# EAGLE design H0FR10 (EAGLE 9.6.1)

## Sheet 1 of 2
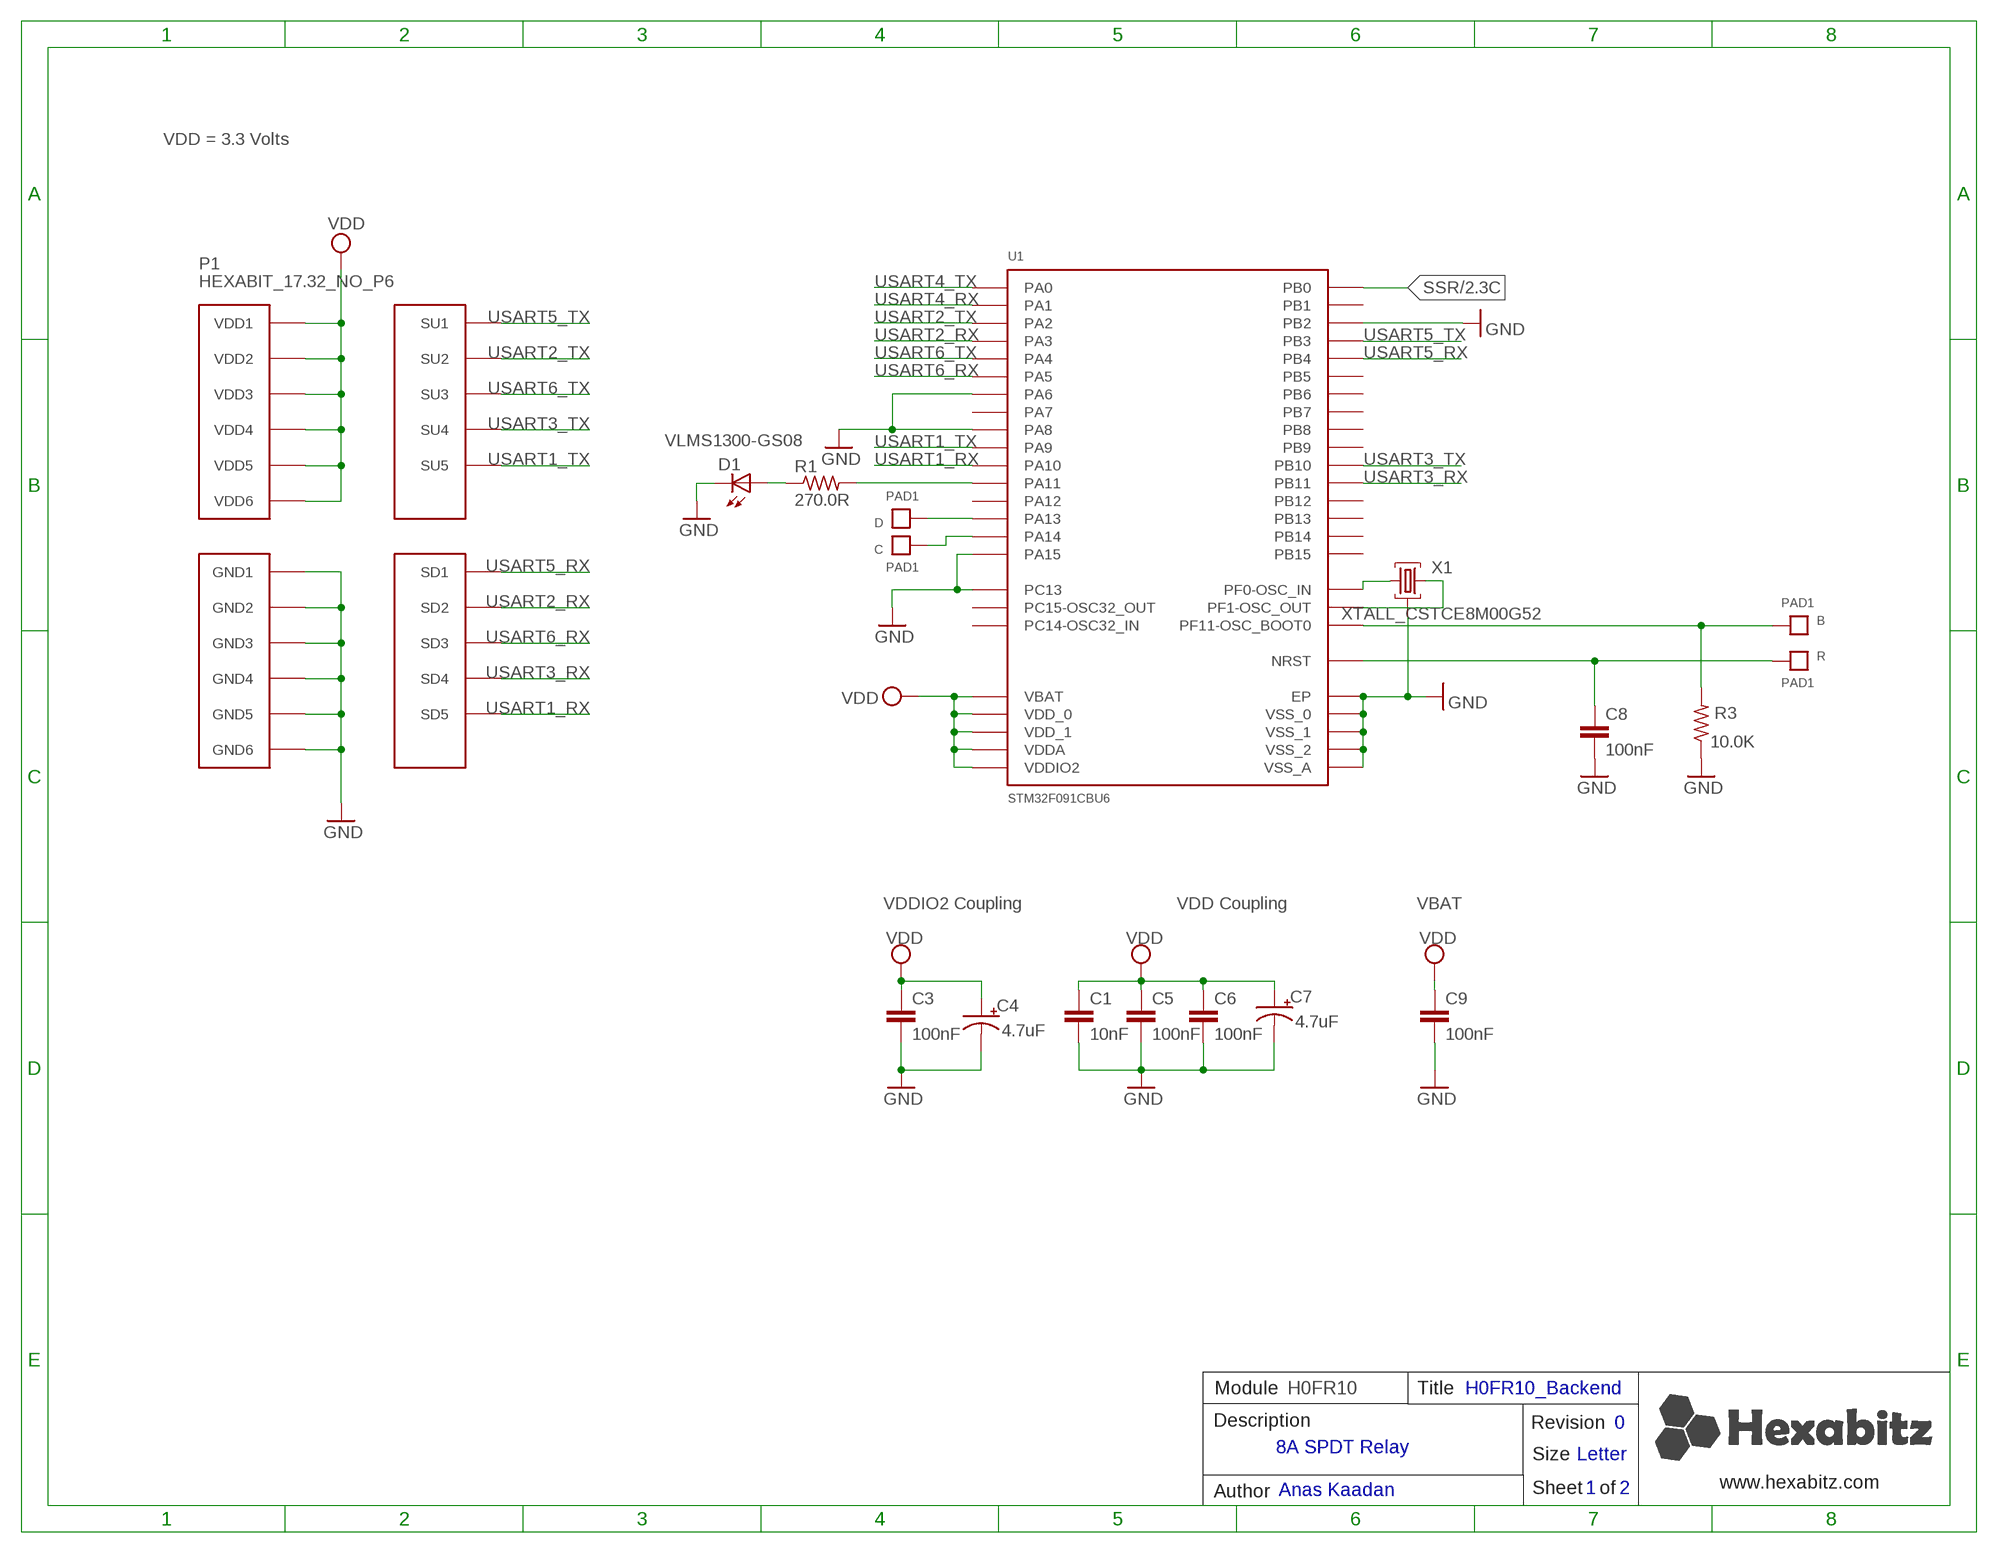
[diagram p0: schematic, sheet 1]

### Parts
B  PAD1  [PAD1]
C  PAD1  [PAD1]
C1  10nF  C-0603  [C-0603]
C3  100nF  C-0603  [C-0603]
C4  4.7uF  C-0805-POL  [C-0805-POL]
C5  100nF  C-0603  [C-0603]
C6  100nF  C-0603  [C-0603]
C7  4.7uF  C-0805-POL  [C-0805-POL]
C8  100nF  C-0603  [C-0603]
C9  100nF  C-0603  [C-0603]
D  PAD1  [PAD1]
D1  VLMS1300-GS08  [VLMS1300-GS08]
P1  HEXABIT_17.32_NO_P6  [HEXABIT_17.32_NO_P6]
R  PAD1  [PAD1]
R1  270.0R  R-0603  [R-0603]
R3  10.0K  R-0603  [R-0603]
U1  STM32F091CBU6  [STM32F091CBU6]
X1  XTALL_CSTCE8M00G52  [XTALL_CSTCE8M00G52]

### Nets
B1: B.P$1 B.P$2 R3.2 U1.P$44(PF11-OSC_BOOT0)
GND: C1.2 C3.2 C4.2(-) C5.2 C6.2 C7.2(-) C8.2 C9.2 D1.C P1.PAD_PD7(GND1) P1.PAD_PD8(GND2) P1.PAD_PD9(GND3) P1.PAD_PD10(GND4) P1.PAD_PD11(GND5) P1.PAD_PD12(GND6) R3.1 U1.EP U1.P$2(PC13) U1.P$8(VSS_A) U1.P$16(PA6) U1.P$20(PB2) U1.P$23(VSS_0) U1.P$29(PA8) U1.P$35(VSS_1) U1.P$38(PA15) U1.P$47(VSS_2) X1.P$2 ; also sheet 2
N$3: R1.2 U1.P$32(PA11)
N$4: D1.A R1.1
N$5: U1.P$5(PF0-OSC_IN) X1.P$1
N$6: U1.P$6(PF1-OSC_OUT) X1.P$3
N$7: D.P$1 D.P$2 U1.P$34(PA13)
N$9: C.P$1 C.P$2 U1.P$37(PA14)
R1: C8.1 R.P$1 R.P$2 U1.P$7(NRST)
SSR: U1.P$18(PB0) ; also sheet 2
USART1_RX: P1.PAD_PD5(SD5) U1.P$31(PA10)
USART1_TX: P1.PAD_PU5(SU5) U1.P$30(PA9)
USART2_RX: P1.PAD_PD2(SD2) U1.P$13(PA3)
USART2_TX: P1.PAD_PU2(SU2) U1.P$12(PA2)
USART3_RX: P1.PAD_PD4(SD4) U1.P$22(PB11)
USART3_TX: P1.PAD_PU4(SU4) U1.P$21(PB10)
USART4_RX: U1.P$11(PA1)
USART4_TX: U1.P$10(PA0)
USART5_RX: P1.PAD_PD1(SD1) U1.P$40(PB4)
USART5_TX: P1.PAD_PU1(SU1) U1.P$39(PB3)
USART6_RX: P1.PAD_PD3(SD3) U1.P$15(PA5)
USART6_TX: P1.PAD_PU3(SU3) U1.P$14(PA4)
VDD: C1.1 C3.1 C4.1(+) C5.1 C6.1 C7.1(+) C9.1 P1.PAD_PU7(VDD1) P1.PAD_PU8(VDD2) P1.PAD_PU9(VDD3) P1.PAD_PU10(VDD4) P1.PAD_PU11(VDD5) P1.PAD_PU12(VDD6) U1.P$1(VBAT) U1.P$9(VDDA) U1.P$24(VDD_0) U1.P$36(VDDIO2) U1.P$48(VDD_1) ; also sheet 2
Unconnected: U1.P$3(PC14-OSC32_IN) U1.P$4(PC15-OSC32_OUT) U1.P$17(PA7) U1.P$19(PB1) U1.P$25(PB12) U1.P$26(PB13) U1.P$27(PB14) U1.P$28(PB15) U1.P$33(PA12) U1.P$41(PB5) U1.P$42(PB6) U1.P$43(PB7) U1.P$45(PB8) U1.P$46(PB9)

### Notes on the sheet
- VDD = 3.3 Volts
- VDDIO2 Coupling | VDD Coupling | VBAT
- Module | H0FR10 | Title | H0FR10_Backend
- Description | Revision | 0
- 8A SPDT Relay
- Size | Letter
- www.hexabitz.com
- Author | Anas Kaadan | Sheet   of | 1 | 2
- C:/Users/Admin/Desktop/logodraft.bmp

## Sheet 2 of 2
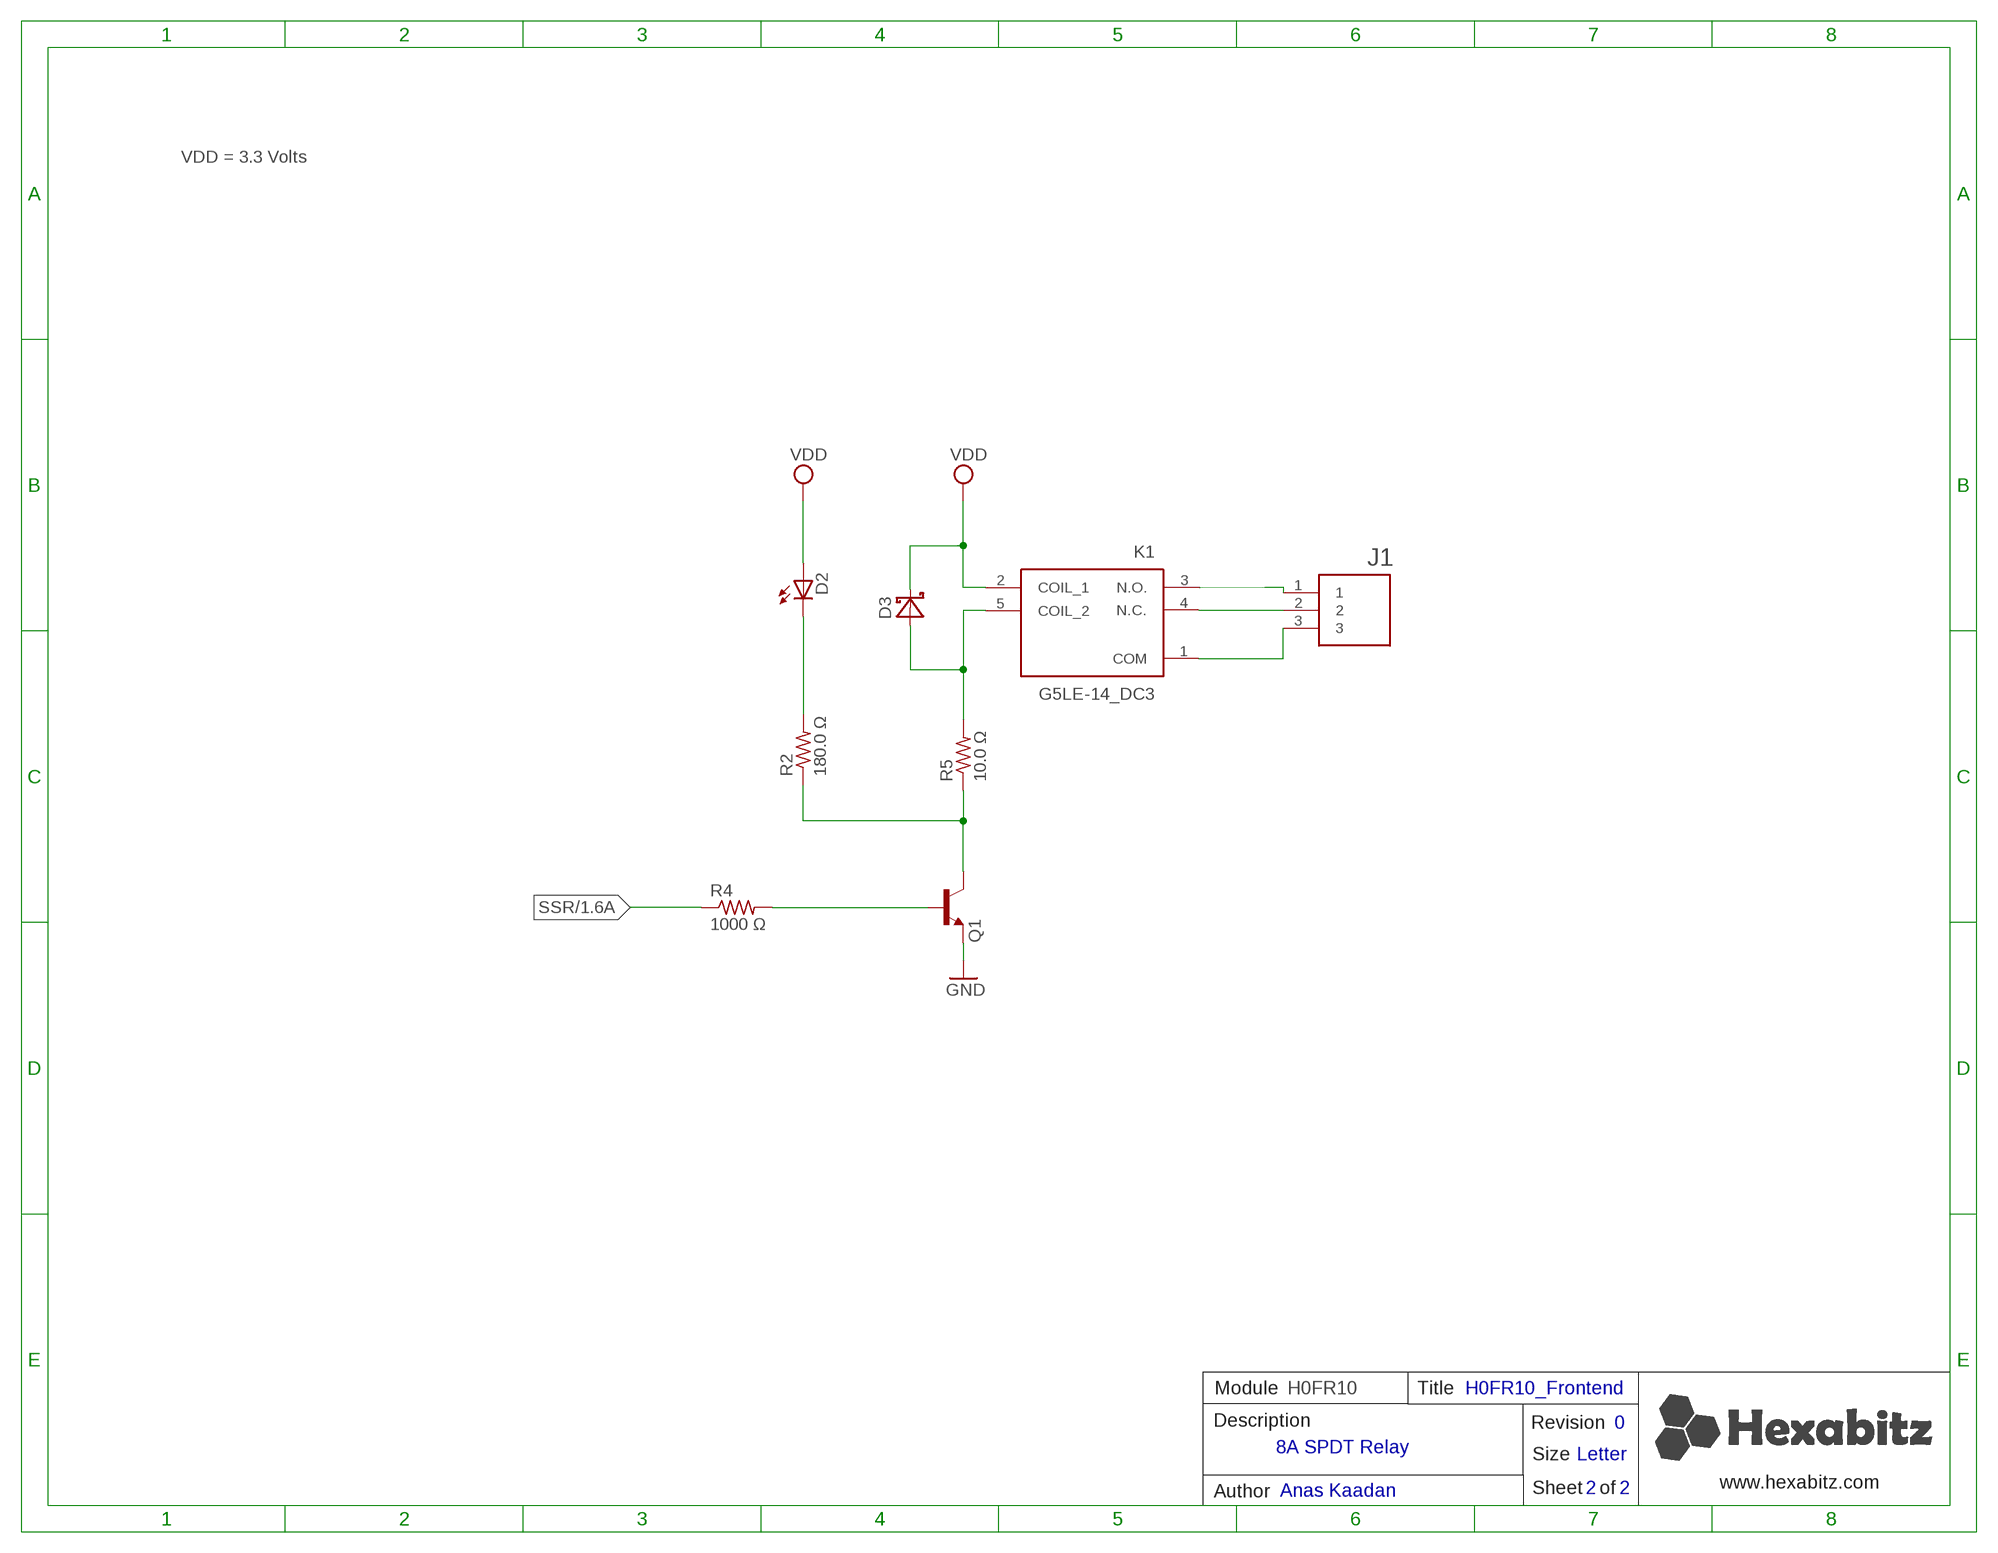
[diagram p1: schematic, sheet 2]

### Parts
D2  VLMS1300-GS08  [VLMS1300-GS08]
D3  SMD-DIODE-SCHOTTKY-40V-300MA(SOD-323)  [SOD-323]
J1  CON-PHOENIX-350_1755749  [SHDR3W100P0X508_1X3_1724X860X1]
K1  G5LE-14_DC3  [G5LE-14_SPDT]
Q1  MMBT3904LT1  [MMBT3904LT1]
R2  180.0 Ω  R-0603  [R-0603]
R4  1000 Ω  R-0603  [R-0603]
R5  10.0 Ω  R-0603  [R-0603]

### Nets
GND: Q1.2(E) ; also sheet 1
N$1: D3.+(A) K1.5(COIL_2) R5.2
N$2: J1.1 K1.3(N.O.)
N$8: D2.C R2.2
N$11: Q1.1(B) R4.2
N$12: J1.2 K1.4(N.C.)
N$13: J1.3 K1.1(COM)
N$15: Q1.3(C) R2.1 R5.1
SSR: R4.1 ; also sheet 1
VDD: D2.A D3.-(C) K1.2(COIL_1) ; also sheet 1

### Notes on the sheet
- VDD = 3.3 Volts
- Module | H0FR10 | Title | H0FR10_Frontend
- Description | Revision | 0
- 8A SPDT Relay
- Size | Letter
- www.hexabitz.com
- Author | Anas Kaadan | Sheet   of | 2 | 2

## Library data of the parts
B C D R = Hexabitz:PAD1
C1 = Hexabitz:C-0603: CAP CER 10% X7R 0603; CAPACITANCE: 10nF; MFN: KEMET; MPN: C0603C103K5RACTU; OCTOPART_URL: https://octopart.com/c0603c103k5ractu-kemet-133094?r=sp&s=R_iPBxLnSmGqhkU2rIMFpg; TOLERANCE: 10%; VOLTAGE_RATING: 50V
C3 C6 C8 = Hexabitz:C-0603: CAP CER 10% X7R 0603; CAPACITANCE: 100nF; MFN: KEMET; MPN: C0603C104K8RACTU; OCTOPART_URL: https://octopart.com/c0603c104k8ractu-kemet-145075?r=sp&s=9bS9ASSwSEqMCE9KBEQZ0g; TOLERANCE: 10%; VOLTAGE_RATING: 10V
C4 C7 = Hexabitz:C-0805-POL: Cap Tant Solid SMD 2012; CAPACITANCE: 4.7uF; MFN: Murata; MPN: GRM21BC81E475KA12L; OCTOPART_URL: https://octopart.com/grm21bc81e475ka12l-murata-10331911?r=sp&s=RY3qZSD8T6mG6TC9CHI5qQ; TOLERANCE: 10%; VOLTAGE_RATING: 25V
C5 = Hexabitz:C-0603: CAP CER 10% X7R 0603; CAPACITANCE: 100nF; MFN: KEMET; MPN: C0603C104K8RACTU; OCTOPART_URL: https://octopart.com/c0603c104k8ractu-kemet-145075?r=sp&s=9bS9ASSwSEqMCE9KBEQZ0g; TOLERANCE: 10%; VOLTAGE_RATING: 10
C9 = Hexabitz:C-0603: CAP CER 10% X7R 0603; CAPACITANCE: 100nF; MFN: KEMET; MPN: C0603C104K8RACTU; OCTOPART_URL: https://octopart.com/c0603c104k8ractu-kemet-145075?r=sp&s=9bS9ASSwSEqMCE9KBEQZ0g; TOLERANCE: 10V; VOLTAGE_RATING: 10%
D1 = Hexabitz:VLMS1300-GS08: Red 0603 130° Clear 54 mcd 2 V Surface Mount ChipLED ; Octopart Url : http://octopart.com/vlms1300-gs08-vishay-21709201; MFN: Vishay; MPN: VLMS1300-GS08; OCTOPART_URL: https://octopart.com/vlms1300-gs08-vishay-21709201?r=sp&s=_gcP4_q8T1SC6PJQPTQ9yA
D2 = Hexabitz:VLMS1300-GS08: Red 0603 130° Clear 54 mcd 2 V Surface Mount ChipLED ; Octopart Url : http://octopart.com/vlms1300-gs08-vishay-21709201; MFN: Vishay; MPN: VLMY1300-GS08; OCTOPART_URL: https://octopart.com/vlmy1300-gs08-vishay-21709204
D3 = Hexabitz:SMD-DIODE-SCHOTTKY-40V-300MA(SOD-323): 304020019; AVAILABILITY: Unavailable; DESCRIPTION: Diode Small Signal Schottky 40V 0.3A Automotive 2-Pin SOD-323 T/R; MF: STMicroelectronics; MP: BAT54JFILM; PACKAGE: SOD-323 STMicroelectronics; PRICE: None
J1 = Hexabitz:CON-PHOENIX-350_1755749: 3 way vertical PCB header,5.08mm pitch Phoenix Contact MSTBVA Series, 5.08mm Pitch 3 Way 1 Row Straight PCB Header, Solder Termination Source: Datasheet <https://componentsearchengine.com/Datasheets/1/1755749.pdf>; ALLIED_NUMBER: 70054652; ALLIED_PRICE-STOCK: https://www.alliedelec.com/phoenixcontact-1755749/70054652/; DESCRIPTION: 3 way vertical PCB header,5.08mm pitch Phoenix Contact MSTBVA Series, 5.08mm Pitch 3 Way 1 Row Straight PCB Header, Solder Termination; HEIGHT: 12mm; MANUFACTURER_NAME: Phoenix Contact; MANUFACTURER_PART_NUMBER: 1755749; MOUSER_PART_NUMBER: 651-1755749; MOUSER_PRICE-STOCK: https://www.mouser.com/Search/Refine.aspx?Keyword=651-1755749; RS_PART_NUMBER: 1896212; RS_PRICE-STOCK: https://uk.rs-online.com/web/p/products/1896212
K1 = Hexabitz:G5LE-14_DC3: General Purpose Relays Power PCB Relay Source: Datasheet <https://omronfs.omron.com/en_US/ecb/products/pdf/en-g5le.pdf>; DESCRIPTION: General Purpose Relays Power PCB Relay; HEIGHT: mm; MANUFACTURER_NAME: Omron Electronics; MANUFACTURER_PART_NUMBER: G5LE-14 DC3; MOUSER_PART_NUMBER: 653-G5LE-14DC3; MOUSER_PRICE-STOCK: https://www.mouser.com/Search/Refine.aspx?Keyword=653-G5LE-14DC3
P1 = hexabitz_connectors:HEXABIT_?_NO_P6: Hexabitz Hexagon Module Connector Hexagon side length = 17.32mm. The following ports are removed: P6
Q1 = Hexabitz:MMBT3904LT1: TRANS NPN 40V 0.2A SOT23; MFN: ON Semiconductor; MOUNTING_STYLE: Surface Mount; MPN: MMBT3904LT1G; NUM_OF_PINS: 3; OCTOPART_ID: 0bb6c2bc2200d471; OCTOPART_URL: http://octopart.com/mmbt3904lt1g-on+semiconductor-3280; PACKAGE: SOT-23-3; PACKAGING: Reel; POLARITY: NPN; POWER_DISSIPATION: 0.225 W; PRODUCT_CATEGORY: Transistors Bipolar-BJT; SERIES: MMBT3904L; VOLTAGE_RATING_DC: 40.0 V
R1 = Hexabitz:R-0603: Thick Film Resistors - SMD 0603; MFN: Yageo; MPN: RC0603FR-07270RL; OCTOPART_URL: https://octopart.com/search?q=RC0603FR-07270RL&start=0; RESISTANCE: 270.0 Ohm; TOLERANCE: 1%
R2 = Hexabitz:R-0603: Thick Film Resistors - SMD 0603; MFN: Panasonic; MPN: ERJ-3GEYJ181V; OCTOPART_URL: https://octopart.com/erj-3geyj181v-panasonic-55403673; RESISTANCE: 180.0 Ω; TOLERANCE: ±5%
R3 = Hexabitz:R-0603: Thick Film Resistors - SMD 0603; MFN: Yageo; MPN: RC0603JR-0710KL; OCTOPART_URL: https://octopart.com/search?q=RC0603JR-0710KL&start=0; RESISTANCE: 10.0K Ohm; TOLERANCE: 5%
R4 = Hexabitz:R-0603: Thick Film Resistors - SMD 0603; MFN: Vishay; MPN: CRCW06031K00JNEA; OCTOPART_URL: https://octopart.com/crcw06031k00jnea-vishay-55388219?r=sp; RESISTANCE: 1000.0 Ω; TOLERANCE: ±5%
R5 = Hexabitz:R-0603: Thick Film Resistors - SMD 0603; MFN: Vishay; MPN: CRCW060310R0FKEB; OCTOPART_URL: https://octopart.com/crcw060310r0fkeb-vishay-42507905?r=sp&s=5DGToXPzTKagwsiDJUkgpw; RESISTANCE: 10 Ohm; TOLERANCE: ±1%
U1 = Hexabitz:STM32F091CBU6: Description : ARM-based 32-bit MCU, CAN, 12 timers, ADC, DAC & Comm. Interface, 2 to 3.6 V, -40 to 85 degC, 48-Pin UFQFPN, RoHS, Tray ;Parameter : Ciiva URL : https://ciiva.com/part/STM32F091CBU6-20240708, CiivaID : 20240708, Clock Speed : 48000000.0 Hz, Lifecycle Status : Active, Mounting Style : Surface Mount, Number of Pins : 48, Octopart Url : https://octopart.com/stm32f091cbu6-stmicroelectronics-51988677, OctopartID : 5f4f955c32ec8088, RAM Memory Size : 32768 B, REACH SVHC Compliance : No SVHC, RoHS : Compliant,; MFN: STMicroelectronics; MPN: STM32F091CBU6; OCTOPART_URL: https://octopart.com/stm32f091cbu6-stmicroelectronics-51988677?r=sp&s=bU6fpgsrTZOxHyt7jkfh3w
X1 = Hexabitz:XTALL_CSTCE8M00G52: MURATA CSTCE8M00G52-R0 RESONATOR, SMD, 8MHZ ; Octopart Url : https://octopart.com/cstce8m00g52-r0-murata-7145559; MFN: Murata; MPN: CSTCE8M00G52Z-R0; OCTOPART_URL: https://octopart.com/cstce8m00g52z-r0-murata-17755941?r=sp&s=JDnNJnrHQhyS8Zk4ofFWXw

## Board
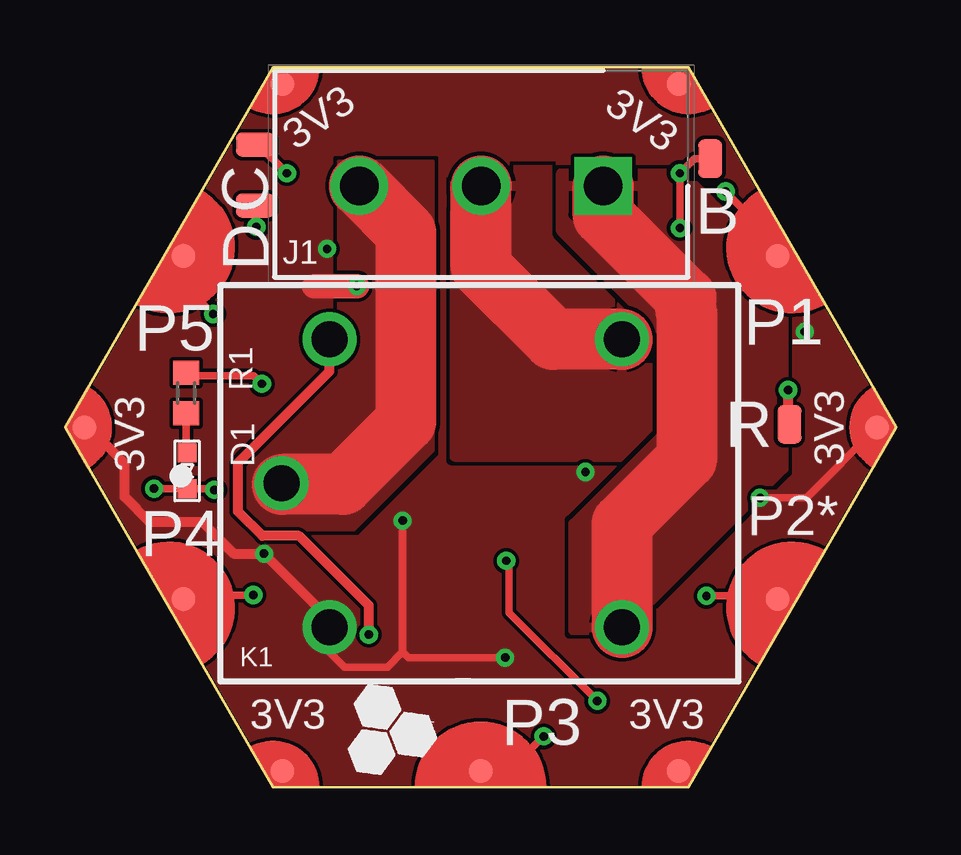
[diagram p2: board, top side]
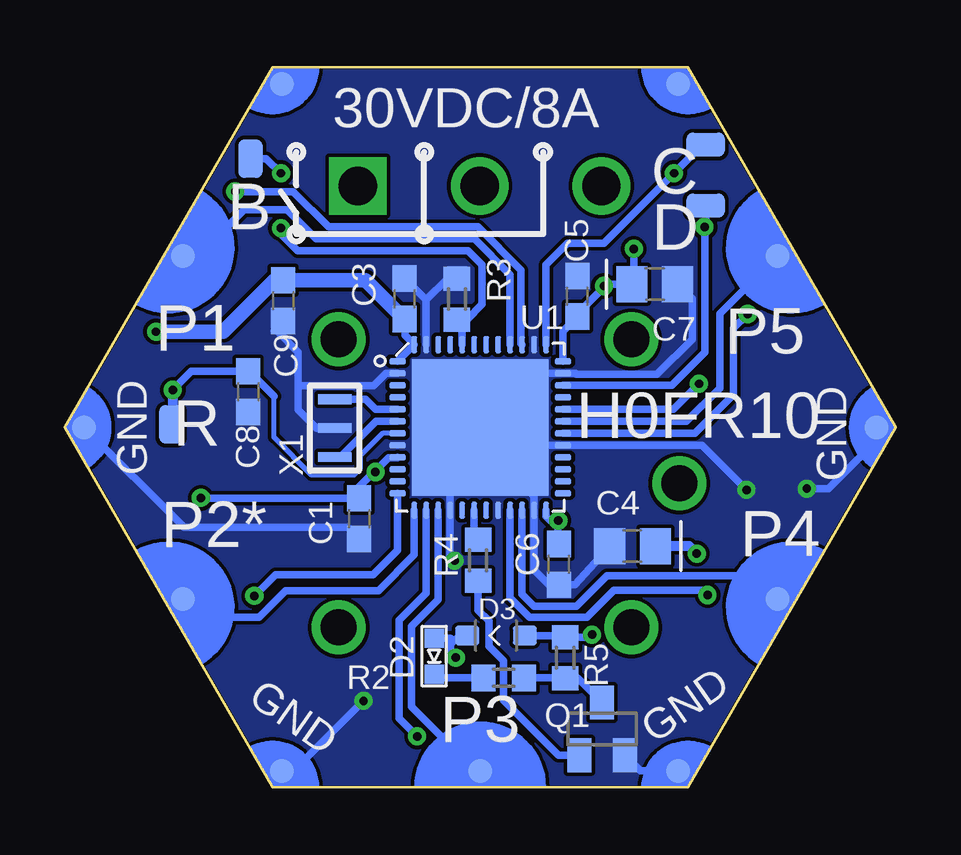
[diagram p3: board, bottom side, seen from below]

Size 34.64 x 30 mm. Coordinates in mm from the lower left corner, seen from the top.
Copper layers (1*16): Top 0.035mm / dielectric 1.5mm / Bottom 0.035mm
Design rules "2_layer": minimum track width 7mil, minimum drill 10mil, track to track 6mil, track to pad 6mil, pad to pad 6mil, via to via 6mil, smd to smd 0mil, copper to edge 1mil, drill to drill 8mil, minimum pad ring 10mil, minimum via ring 8mil, stop-mask expansion 2mil, vias tented up to drill 15mil, thermal gap 10mil

### Footprints (pad centres in the part's own frame; a part is rotated, then mirrored left to right if it is on the bottom)
PAD1 = smd 1.6 x 1: P$1 0,0 | smd 1.6 x 1 bottom: P$2 0,0
C-0603 = smd 1.1 x 1: 1 -0.85,0; 2 0.85,0
C-0805-POL = smd 1.3 x 1.5: 1 -0.95,0; 2 0.95,0
VLMS1300-GS08 = smd 0.8 x 0.8: A 0,0.75; C 0,-0.75
SOD-323 = smd 1 x 0.8: + -1.2,0; - 1.2,0
SHDR3W100P0X508_1X3_1724X860X1 = drill 1.6 pad 2.4 square: 1 0,0 | drill 1.6 pad 2.4: 2 5.08,0; 3 10.16,0
G5LE-14_SPDT = drill 1.5 pad 2.25: 1 -2,6; 2 0,0; 3 12.2,0; 4 12.2,12; 5 0,12
HEXABIT_17.32_NO_P6 = smd 1 x 1 bottom: PAD_PD1 12.39,7.15; PAD_PD2 12.39,-7.15; PAD_PD3 0,-14.31; PAD_PD4 -12.39,-7.15; PAD_PD5 -12.39,7.15; PAD_PD7 8.26,14.31; PAD_PD8 16.52,0; PAD_PD9 8.26,-14.31; PAD_PD10 -8.26,-14.31; PAD_PD11 -16.52,0; PAD_PD12 -8.26,14.31 | smd 1 x 1: PAD_PU1 12.39,7.15; PAD_PU2 12.39,-7.15; PAD_PU3 0,-14.31; PAD_PU4 -12.39,-7.15; PAD_PU5 -12.39,7.15; PAD_PU7 8.26,14.31; PAD_PU8 16.52,0; PAD_PU9 8.26,-14.31; PAD_PU10 -8.26,-14.31; PAD_PU11 -16.52,0; PAD_PU12 -8.26,14.31
MMBT3904LT1 = smd 1 x 1.4: 1 -0.95,-1.1; 2 0.95,-1.1; 3 0,1.1
R-0603 = smd 1 x 1.1: 1 -0.85,0; 2 0.85,0
STM32F091CBU6 = smd 5.7 x 5.7: EP 0,0 | smd 0.25 x 0.7: P$1 -2.75,-3.45; P$2 -2.25,-3.45; P$3 -1.75,-3.45; P$4 -1.25,-3.45; P$5 -0.75,-3.45; P$6 -0.25,-3.45; P$7 0.25,-3.45; P$8 0.75,-3.45; P$9 1.25,-3.45; P$10 1.75,-3.45; P$11 2.25,-3.45; P$12 2.75,-3.45; P$25 2.75,3.45; P$26 2.25,3.45; P$27 1.75,3.45; P$28 1.25,3.45; P$29 0.75,3.45; P$30 0.25,3.45; P$31 -0.25,3.45; P$32 -0.75,3.45; P$33 -1.25,3.45; P$34 -1.75,3.45; P$35 -2.25,3.45; P$36 -2.75,3.45 | smd 0.7 x 0.25: P$13 3.45,-2.75; P$14 3.45,-2.25; P$15 3.45,-1.75; P$16 3.45,-1.25; P$17 3.45,-0.75; P$18 3.45,-0.25; P$19 3.45,0.25; P$20 3.45,0.75; P$21 3.45,1.25; P$22 3.45,1.75; P$23 3.45,2.25; P$24 3.45,2.75; P$37 -3.45,2.75; P$38 -3.45,2.25; P$39 -3.45,1.75; P$40 -3.45,1.25; P$41 -3.45,0.75; P$42 -3.45,0.25; P$43 -3.45,-0.25; P$44 -3.45,-0.75; P$45 -3.45,-1.25; P$46 -3.45,-1.75; P$47 -3.45,-2.25; P$48 -3.45,-2.75
XTALL_CSTCE8M00G52 = smd 1.4 x 0.4: P$1 0,1.2; P$2 0,0; P$3 0,-1.2

### Placement (x,y rotation side)
B  26.9,26.2 90 top
C  7.92,26.79 0 top
C1  22.36,11.2 270 bottom
C3  20.47,20.36 90 bottom
C4  10.97,10.05 180 bottom
C5  13.26,20.47 90 bottom
C6  14.05,9.3 270 bottom
C7  10.04,20.98 0 bottom
C8  26.99,16.49 270 bottom
C9  25.54,20.28 270 bottom
D  7.92,24.25 180 top
D1  5.08,13.19 0 top
D2  19.24,5.47 0 bottom
D3  16.66,6.33 180 bottom
J1  22.43,25.06 180 top
K1  11.02,6.67 0 top
P1  17.32,15 0 top
Q1  12.24,2.44 0 bottom
R  30.2,15.13 90 top
R1  5.04,16.43 90 top
R2  16.34,4.56 180 bottom
R3  18.29,20.35 270 bottom
R4  17.41,9.47 270 bottom
R5  13.78,5.4 90 bottom
U1  17.32,15 270 bottom
X1  23.39,14.97 0 bottom

### Tracks (layer width: path | path; a pad name or v marks a point on that pad's centre or on a via)
B1  (via drill 0.35)
  Top 0.305: B.P$1 26.24,26.2 v25.63,25.59 v25.63,23.31
  Bottom 0.305: U1.P$44 18.07,19.27 R3.2 17.88,19.5 17.24,20.13 17.24,21.78 17.82,22.36 24.93,22.36 25.63,23.05 v25.63,23.31 | v25.63,25.59 26.24,26.2 B.P$1
GND  (via drill 0.35)
  Top 0.305: v3.71,12.45 v3.71,12.44 D1.C 6.17,12.44 v6.22,12.4 | v18.39,9.44 18.51,9.32 18.51,7.28 v22.18,3.61
  Bottom 0.305: 18.64,21.58 17.91,21.58 | C5.2 13.24,21.3 | 17.32,12.62 U1.EP 17.32,17.05 | 17.32,12.62 | 17.32,17.05 18.76,17.05 18.96,17.25 | 17.32,17.05 15.8,17.05 15.61,17.25 U1.P$35 13.35,17.25 13.31,17.21 9.95,17.21 8.48,18.68 8.48,20.37 C7.2 | 15.54,12.61 15.07,12.14 U1.P$23 15.07,9.07 14.45,8.45 C6.2 13.38,8.45 C4.2 | 15.54,12.61 17.31,12.61 | 17.31,12.61 17.32,12.62 | X1.P$2 24.15,14.97 24.9,15.73 24.9,16.73 | 25.91,19.03 25.8,19.03 24.9,18.14 24.9,16.73 | U1.P$47 19.57,20.31 | 19.57,20.31 C3.2 | 19.57,20.31 18.69,21.2 R3.1 | P1.PAD_PD11 0.8,14.45 2.8,12.45 v3.71,12.45 | 17.31,12.61 18.16,12.61 18.57,12.2 U1.P$16 18.57,9.63 v18.39,9.44 | U1.P$2 21.25,17.25 21.77,16.73 24.9,16.73 | 15.54,12.61 15.54,13.82 15.11,14.25 U1.P$29 8.07,14.25 v6.22,12.4 | Q1.2 10.64,0.69 P1.PAD_PD10 | C1.2 22.85,10.83 29.67,10.83 P1.PAD_PD8 | v22.18,3.61 25.1,0.69 P1.PAD_PD9
  pour Bottom (rank 2, no thermals): 8.66,0 25.98,0 34.64,15 25.98,30 8.66,30 0,15
N$1  (via drill 0.35)
  Top 0.406: v12.66,6.36 12.66,7.57 9.75,10.48 8.23,10.48 7.21,11.49 7.21,13.53 11.02,17.34 K1.5
  Bottom 0.305: D3.+ 13.85,6.33 R5.2 12.77,6.25 v12.66,6.36
N$2
  Top 2.54: 22.43,24.43 J1.1 22.43,23.84 25.88,20.38 25.88,19.82 25.91,19.79 25.91,13.69 23.21,10.99 K1.3
  pour Top: 20.67,25.59 25.75,25.59 29.94,21.4 29.94,13.27 23.21,6.54 21.18,6.54 21.18,10.99 25.63,15.43 25.63,18.23 20.67,23.18
N$3  (via drill 0.35)
  Top 0.305: v8.2,16.82 7.86,17.16 5.17,17.16 R1.2
  Bottom 0.305: U1.P$32 9.27,15.75 v8.2,16.82
N$4
  Top 0.305: R1.1 5.04,13.94 D1.A
N$5
  Bottom 0.305: U1.P$5 21.68,15.75 22.1,16.17 X1.P$1
N$6
  Bottom 0.305: U1.P$6 21.66,15.25 23.13,13.77 X1.P$3
N$7  (via drill 0.35)
  Top 0.305: v7.97,23.36 7.92,23.41 D.P$1
  Bottom 0.305: D.P$1 7.92,23.41 v7.97,23.36 7.95,23.36 7.95,18.14 9.34,16.75 U1.P$34
N$8
  Bottom 0.305: R2.2 19.08,4.56 D2.C
N$9  (via drill 0.35)
  Top 0.305: v9.24,25.59 8.05,26.79 C.P$1
  Bottom 0.305: C.P$1 8.05,26.79 v9.24,25.59 12.16,22.67 13.69,22.67 14.57,21.79 U1.P$37
N$11
  Bottom 0.305: Q1.1 14.06,1.34 16.35,3.63 16.35,5.27 16.96,5.88 16.96,6.95 17.41,7.39 R4.2
N$12
  Top 2.54: K1.4 20.36,18.67 17.35,21.68 J1.2
  pour Top (rank 2): 16.23,25.72 16.23,13.78 24.36,13.78 24.36,25.72
N$13
  Top 1.016: 9.06,12.62 K1.1
  Top 2.54: 9.06,12.62 11.58,12.62 14.21,15.25 14.21,23.12 J1.3
  pour Top (rank 2, no thermals): 7.34,11.49 8.13,10.7 12.05,10.75 15.34,14.03 15.34,26.1 11.4,26.1 11.4,17.72 7.34,13.65
N$15
  Bottom 0.305: Q1.3 13.25,4.55 R5.1 13.79,4.56 R2.1
R1  (via drill 0.35)
  Top 0.406: v30.14,16.56 30.14,15.19 R.P$1
  Bottom 0.203: U1.P$7 21.4,14.75 22.31,13.84 22.31,13.29 22.57,13.03 24.36,13.03 25.92,14.58 25.92,16.31
  Bottom 0.305: v30.14,16.56 29.37,17.33 C8.1 26.96,17.34 25.92,16.31
  Bottom 0.406: v30.14,16.56 30.14,15.19 R.P$1
SSR
  Bottom 0.305: U1.P$18 17.57,10.48 R4.1
USART1_RX
  Bottom 0.305: U1.P$31 8.73,15.25 7.34,16.64 7.34,19.74 P1.PAD_PD5
USART1_TX  (via drill 0.35)
  Top 0.305: v6.17,19.72 4.93,20.96 P1.PAD_PU5
  Bottom 0.305: v6.17,19.72 6.76,19.13 6.76,16.35 8.37,14.75 U1.P$30
USART2_RX
  Bottom 0.305: U1.P$13 20.07,9.68 21.56,8.19 25.43,8.19 26.53,7.09 28.95,7.09 P1.PAD_PD2
USART2_TX  (via drill 0.35)
  Top 0.305: v26.73,7.98 29.58,7.98 P1.PAD_PU2
  Bottom 0.305: v26.73,7.98 25.84,8.87 25.46,8.87 21.79,8.86 20.76,9.89 U1.P$12
USART3_RX
  Bottom 0.305: U1.P$22 15.57,8.04 15.08,7.56 13.31,7.56 12.04,8.83 5.91,8.83 P1.PAD_PD4
USART3_TX  (via drill 0.35)
  Top 0.305: v7.85,8.02 5.1,8.02 P1.PAD_PU4
  Bottom 0.305: U1.P$21 16.07,7.9 15.27,7.1 12.86,7.1 11.74,8.23 8.05,8.23 v7.85,8.02
USART5_RX
  Bottom 0.305: U1.P$40 16.07,21.37 17.56,22.86 24.16,22.86 25.37,24.07 27.16,24.07 29.07,22.15 P1.PAD_PD1
USART5_TX  (via drill 0.35)
  Top 0.305: v27.53,24.83 29.03,23.33 P1.PAD_PU1
  Bottom 0.305: U1.P$39 15.61,18.49 15.61,21.56 17.41,23.36 23.64,23.36 25.12,24.83 v27.53,24.83
USART6_RX
  Bottom 0.305: U1.P$15 19.07,7.81 20.18,6.71 20.18,3.35 17.51,0.69 P1.PAD_PD3
USART6_TX  (via drill 0.35)
  Top 0.305: P1.PAD_PU3 17.32,0.82 18.64,0.82 v19.95,2.12
  Bottom 0.305: U1.P$14 19.57,8.09 20.7,6.96 20.7,2.87 v19.95,2.12
VDD  (via drill 0.35)
  Top 0.305: v14.07,11.11 14.07,5.65 | 14.07,5.65 13.43,5.02 11.64,5.02 11.02,5.64 K1.2 | P1.PAD_PU8 30.91,12.07 v28.97,12.07 | v18.34,5.41 14.31,5.41 14.07,5.65
  Top 0.406: K1.2 11.02,7 v8.29,9.73 v8.29,9.74 7.03,9.74 5.72,11.05 3.53,11.05 2.47,12.11 2.47,13.5 0.97,15
  Top 1.016: 0.97,15 P1.PAD_PU11 | v12.16,20.89 10.39,20.89
  Bottom 0.305: C3.1 20.45,19.49 20.45,18.83 U1.P$48 U1.P$1 | U1.P$36 13.87,19.01 C5.1 13.26,19.74 12.03,20.97 C7.1 10.92,21.05 v10.92,22.44 | C6.1 14.07,10.17 v14.07,11.11 14.39,11.11 14.57,11.3 U1.P$24 | U1.P$9 21.15,13.74 22.36,12.52 C1.1 28.95,12.05 v28.97,12.07 | D2.A 18.56,6.22 18.56,6.05 | 18.56,6.05 18.47,6.05 18.18,6.33 D3.- | 18.56,6.05 18.56,5.63 v18.34,5.41
  Bottom 0.406: 9.71,9.74 C4.1 8.6,10.05 v8.29,9.74
  Bottom 0.61: v30.83,18.99 28.03,18.99 25.89,21.13 C9.1 22.09,21.13 20.45,19.49
  other vias: 21.69,13.15
  pour Top (rank 3, no thermals): 8.66,0 25.98,0 34.64,15 25.98,30 8.66,30 0,15

### Text on the board
tPlace: 3V3 | 3V3 | P5 | P1 | 3V3 | 3V3 | P2* | P4 | 3V3 | 3V3 | P3
bPlace: 30VDC/8A | P5 | P1 | H0FR10 | GND | GND | P2* | P4 | GND | GND | P3
bNames: C | B | D | R
tDocu: Note: This module should be manufactured with 2oz copper to handle 8A current.